# Altium project Bottom.PrjPcb
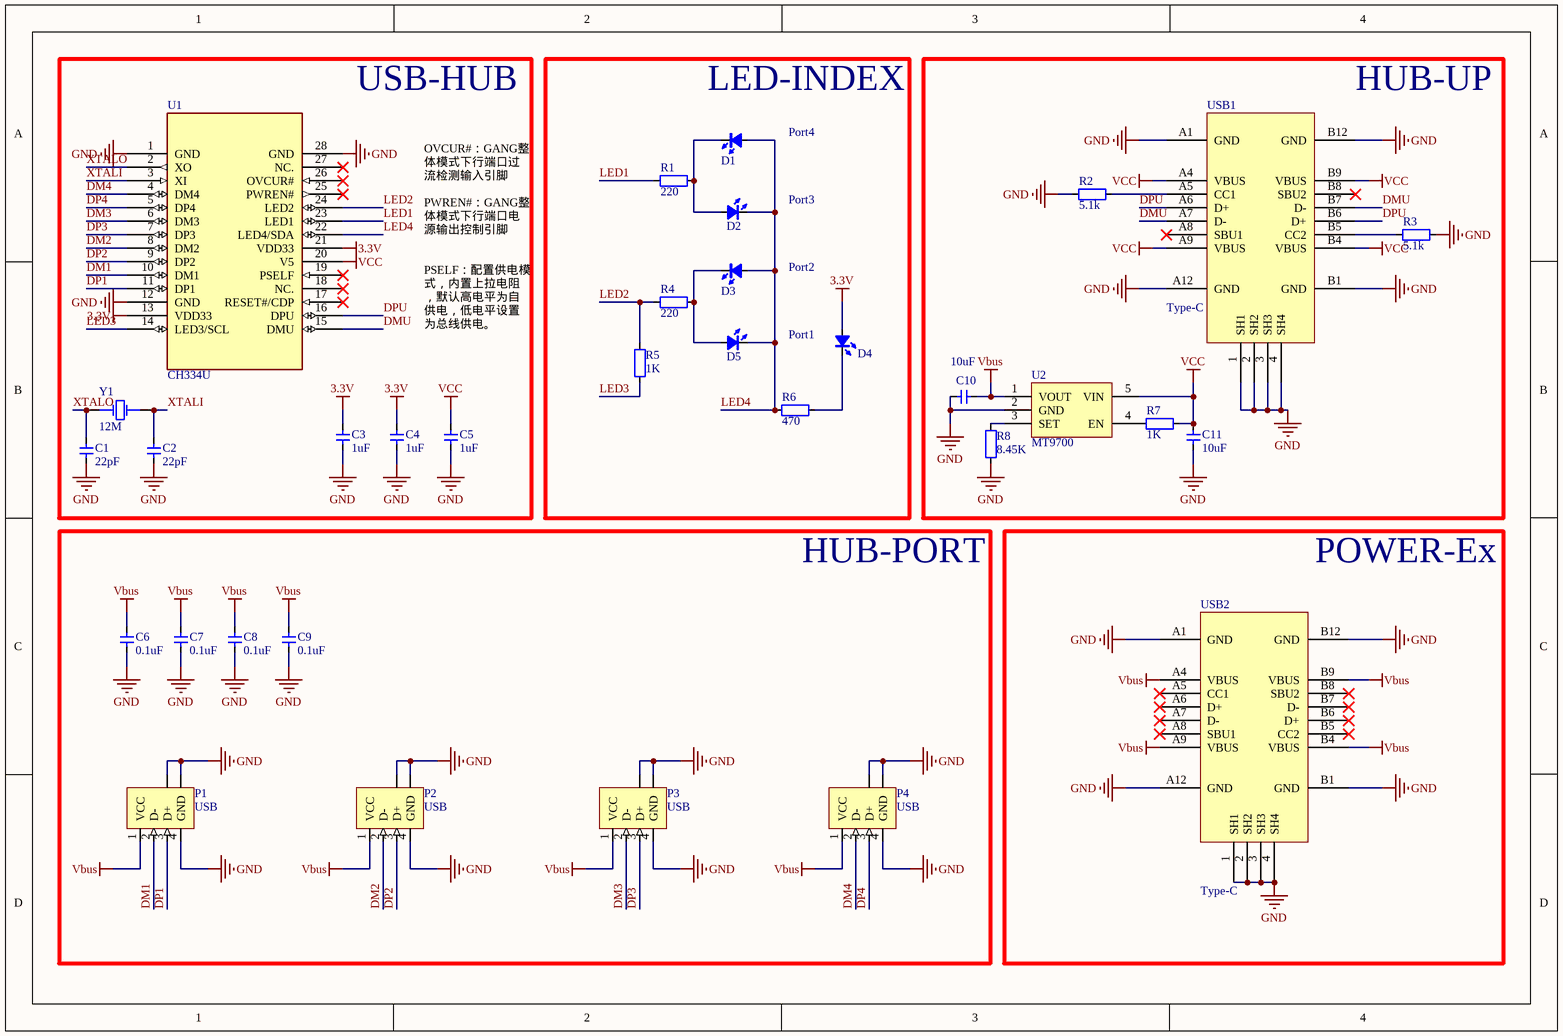
[diagram p0: Sheet1.SchDoc]
1 sheet, 33 parts. Net scope: global (net labels, ports and power ports of the same name join across sheets).
Board file: PCB1.PcbDoc

## Sheet Sheet1.SchDoc
size A4; SheetNumber: 1; SheetTotal: 1

### Parts
C1  22pF  [C0603]
C2  22pF  [C0603]
C3  1uF  [C0603]
C4  1uF  [C0603]
C5  1uF  [C0603]
C6  0.1uF  [C0603]
C7  0.1uF  [C0603]
C8  0.1uF  [C0603]
C9  0.1uF  [C0603]
C10  10uF  [C0603]
C11  10uF  [C0603]
D1  color?  [LED0603]  (value not drawn)
D2  color?  [LED0603]  (value not drawn)
D3  color?  [LED0603]  (value not drawn)
D4  color?  [LED0603]  (value not drawn)
D5  color?  [LED0603]  (value not drawn)
P1  USB  [USBB]
P2  USB  [USBB]
P3  USB  [USBB]
P4  USB  [USBB]
R1  220  [R0603]
R2  5.1k  [R0603]
R3  5.1k  [R0603]
R4  220  [R0603]
R5  1K  [R0603]
R6  470  [R0603]
R7  1K  [R0603]
R8  8.45K  [R0603]
U1  CH334U  [QSOP28]
U2  MT9700  [SOT23-5]
USB1  Type-C  [Type-C-TOP]
USB2  Type-C  [Type-C-TOP]
Y1  12M  [5032 2Pin]

### Blocks framed on the sheet
USB-HUB: C1-C5 U1 Y1
LED-INDEX: D1-D5 R1 R4-R6
HUB-UP: C10 C11 R2 R3 R7 R8 U2 USB1
HUB-PORT: C6-C9 P1-P4
POWER-Ex: USB2

### Nets
3.3V: C3.2 C4.2 D4.1(A) U1.13(VDD33) U1.21(VDD33)
GND: C1.1 C2.1 C3.1 C4.1 C5.1 C6.1 C7.1 C8.1 C9.1 C10.2 C11.1 P1.4(GND) P1.5(SHLD) P1.6(SHLD) P2.4(GND) P2.5(SHLD) P2.6(SHLD) P3.4(GND) P3.5(SHLD) P3.6(SHLD) P4.4(GND) P4.5(SHLD) P4.6(SHLD) R2.1 R3.2 R8.1 U1.1(GND) U1.12(GND) U1.28(GND) U2.2(GND) USB1.1(SH1) USB1.2(SH2) USB1.3(SH3) USB1.4(SH4) USB1.A1(GND) USB1.A12(GND) USB1.B1(GND) USB1.B12(GND) USB2.1(SH1) USB2.2(SH2) USB2.3(SH3) USB2.4(SH4) USB2.A1(GND) USB2.A12(GND) USB2.B1(GND) USB2.B12(GND)
Vbus: C6.2 C7.2 C8.2 C9.2 C10.1 P1.1(VCC) P2.1(VCC) P3.1(VCC) P4.1(VCC) U2.1(VOUT) USB2.A4(VBUS) USB2.A9(VBUS) USB2.B4(VBUS) USB2.B9(VBUS)
VCC: C5.2 C11.2 R7.2 U1.20(V5) U2.5(VIN) USB1.A4(VBUS) USB1.A9(VBUS) USB1.B4(VBUS) USB1.B9(VBUS)
DM1: P1.2(D-) U1.10(DM1)
DM2: P2.2(D-) U1.8(DM2)
DM3: P3.2(D-) U1.6(DM3)
DM4: P4.2(D-) U1.4(DM4)
DMU: U1.15(DMU) USB1.A7(D-) USB1.B7(D-)
DP1: P1.3(D+) U1.11(DP1)
DP2: P2.3(D+) U1.9(DP2)
DP3: P3.3(D+) U1.7(DP3)
DP4: P4.3(D+) U1.5(DP4)
DPU: U1.16(DPU) USB1.A6(D+) USB1.B6(D+)
LED1: R1.1 U1.23(LED1)
LED2: R4.1 R5.2 U1.24(LED2)
LED3: R5.1 U1.14(LED3/SCL)
LED4: D1.1(A) D2.2(K) D3.1(A) D5.2(K) R6.2 U1.22(LED4/SDA)
XTALI: C2.2 U1.3(XI) Y1.2(OSC2)
XTALO: C1.2 U1.2(XO) Y1.1(OSC1)
NetD1_2: D1.2(K) D2.1(A) R1.2
NetD3_2: D3.2(K) D5.1(A) R4.2
NetD4_2: D4.2(K) R6.1
NetR2_2: R2.2 USB1.A5(CC1)
NetR3_1: R3.1 USB1.B5(CC2)
NetR7_1: R7.1 U2.4(EN)
NetR8_2: R8.2 U2.3(SET)

Not connected (* = marked no-connect by the designer): U1 17(RESET#/CDP)* 18(NC.)* 19(PSELF)* 25(PWREN#)* 26(OVCUR#)* 27(NC.)*; USB1 A8(SBU1)* B8(SBU2)*; USB2 A5(CC1)* A6(D+)* A7(D-)* A8(SBU1)* B5(CC2)* B6(D+)* B7(D-)* B8(SBU2)*

### Notes on the sheet
- (near D1) Port4
- OVCUR#：GANG整体模式下行端口过流检测输入引脚
- PWREN#：GANG整体模式下行端口电源输出控制引脚
- Port3
- Port2
- PSELF：配置供电模式，内置上拉电阻，默认高电平为自供电，低电平设置为总线供电。
- (near D4) Port1

### Library data of the parts
C1-C11 = 贴片C: Capacitor; Value: 104; Published: 8-Jun-2000; LatestRevisionDate: 17-Jul-2002; LatestRevisionNote: Re-released for DXP Platform.; PackageReference: RAD-0.3; Publisher: Altium Limited
D1-D5 = 贴片LED: LED; Type: 0402; Value: color?
P1-P4 = USB: USB 1.1, Right Angle, SMT, A Type, Plug, 4 Position, Natural; ContactMaterial: Brass; ContactPlating: Gold (30) over Nickel (50); PCB_Layout: Complies with manufacturer's recommendation.; DrillSize: Corresponds to nominal value.; PanelGround: Without; Published: 15-Jul-2004; DatasheetDocument: 21-Jan-2003; PackageDocument: 21-Jan-2003; PackageReference: 1470695A; Publisher: Altium Limited; HousingMaterial: Thermoplastic; ComponentLink1Description: Manufacturer Link; ComponentLink1URL: http://www.tycoelectronics.com/; ComponentLink2Description: Packaging Specification; ComponentLink2URL: http://ecommas.tycoelectronics.com/commerce/DocumentDelivery/DDEController?Action=showdoc&DocId=Customer+Drawing%7F1470695%7FO%7Fpdf%7FEnglish%7FC_1470695_O.pdf
R1-R4 R6 R8 = 贴片R: Resistor; Value: 1K; Published: 8-Jun-2000; Revision: July-2002: Re-released for DXP Platform.; Publisher: Altium Limited
R5 R7 = 贴片R: Resistor; Published: 8-Jun-2000; Revision: July-2002: Re-released for DXP Platform.; Publisher: Altium Limited; Value: 1K
U1 = CH334U: 4 ports High-Speed USB MTT Hub with over current detect & power control
U2 = MT9700: USB电流保护
USB1 USB2 = USB-Type-C-TOP
Y1 = XTAL 8Mhz 2pin